# Altium schematic sheet BatteryBoxRight.SchDoc
size A1
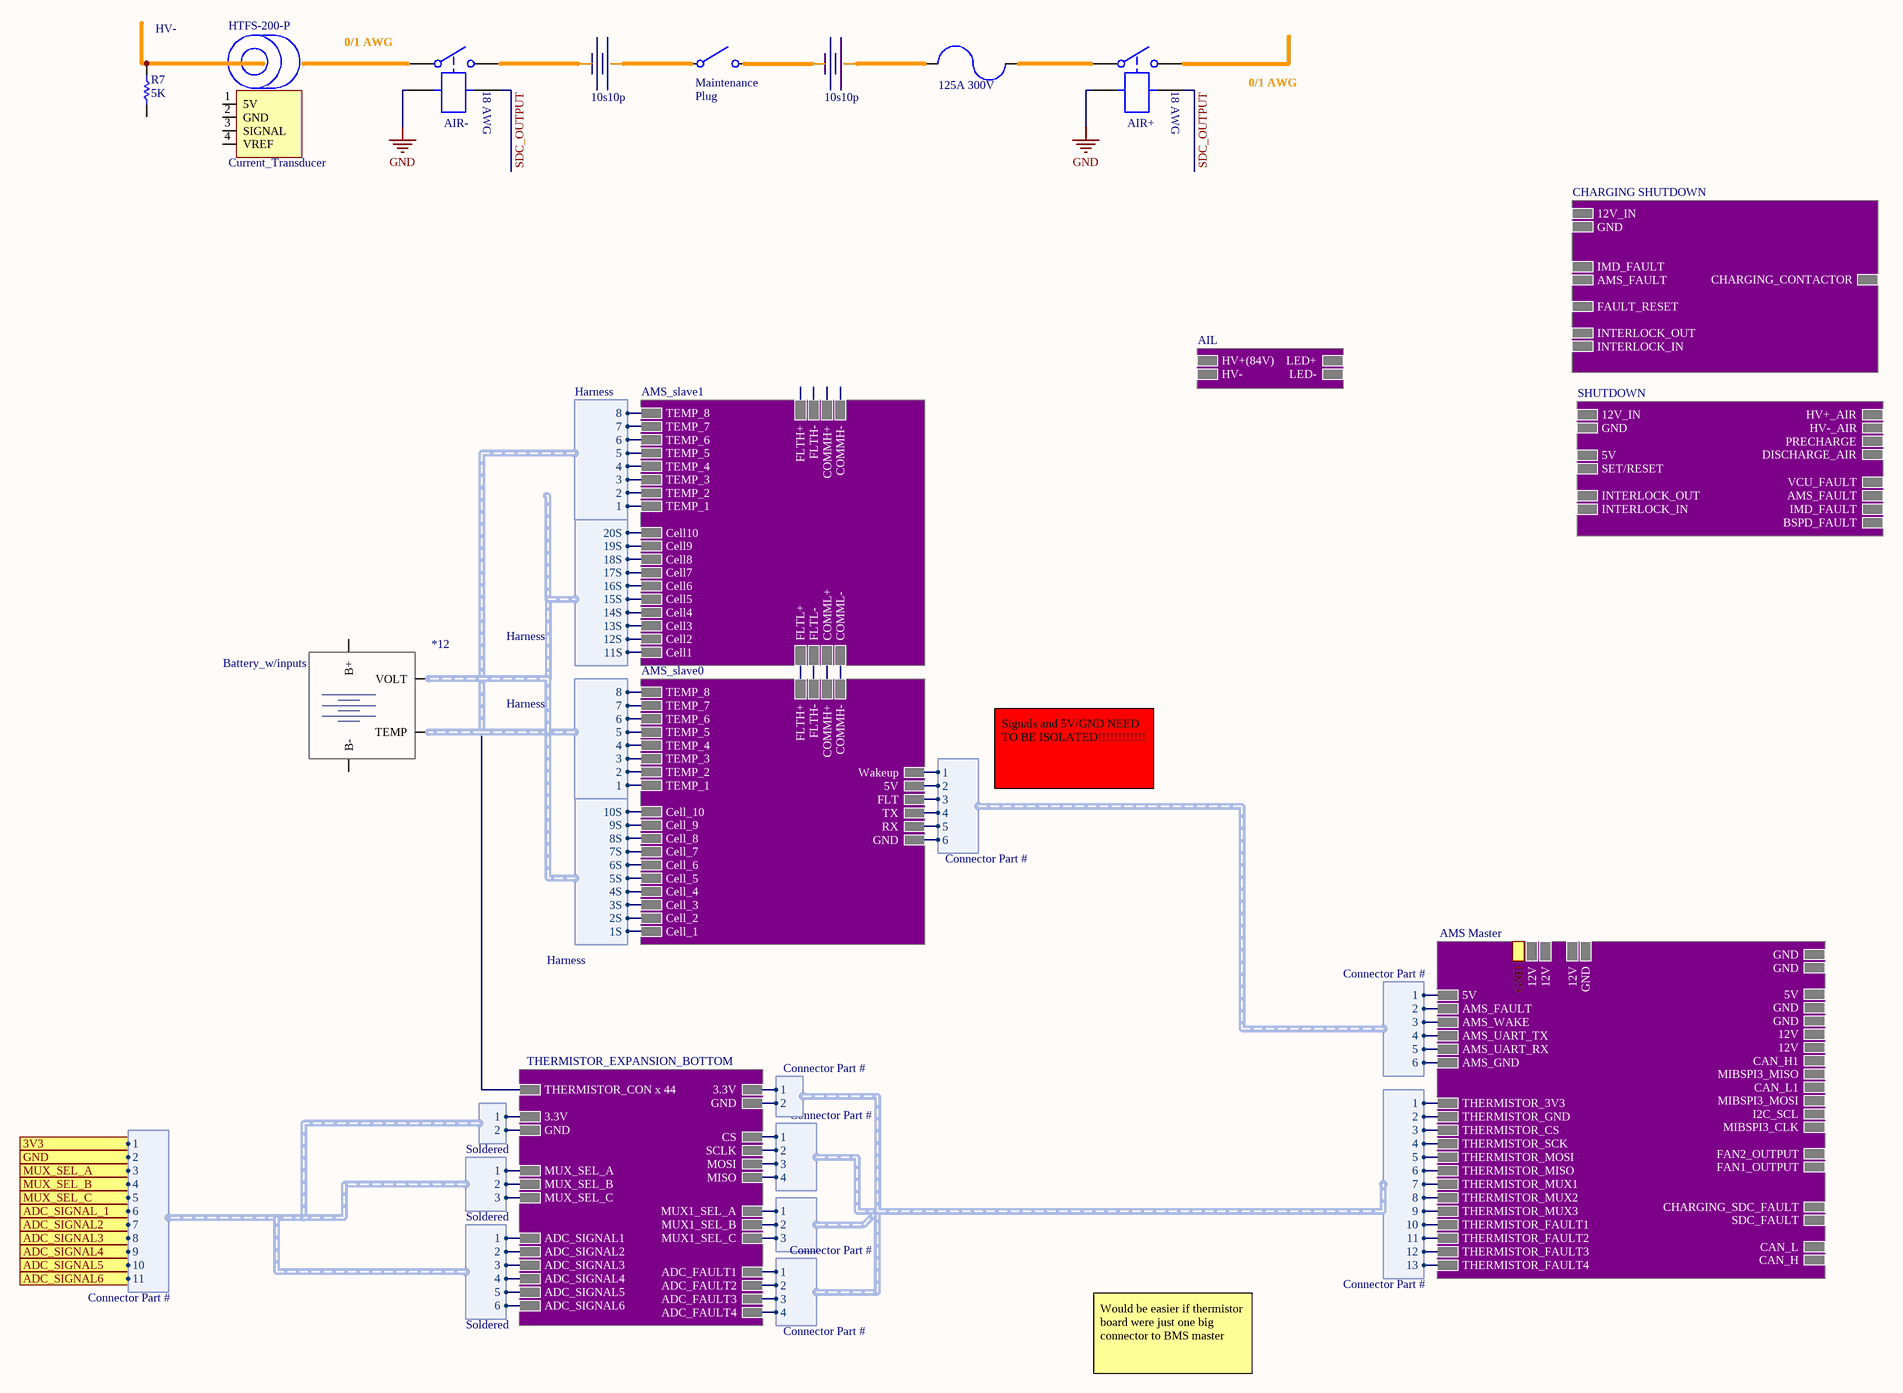
[diagram p0: BatteryBoxRight.SchDoc]

## Parts
10  AIR-
12  125A 300V
13  AIR+
*12  Battery_w/inputs
HTFS-200-P  Current_Transducer
N/A  10s10p
N/A1  10s10p
Plug4  Maintenance_Plug  (value not drawn)
R7  5K

## Sub-sheets
AIL = ?: HV+(84V), HV-, LED+, LED-
AMS Master = ?: 12V, 12V, GND, THERMISTOR_GND, THERMISTOR_3V3, THERMISTOR_FAULT4, THERMISTOR_FAULT3, THERMISTOR_FAULT2, THERMISTOR_FAULT1, THERMISTOR_MUX3, THERMISTOR_MUX2, THERMISTOR_MUX1, THERMISTOR_SCK, THERMISTOR_MISO, AMS_UART_TX, THERMISTOR_MOSI, AMS_UART_RX, THERMISTOR_CS, AMS_FAULT, AMS_WAKE, GND, GND, 5V, 5V, GND, GND, 12V, 12V, CAN_H1, MIBSPI3_MISO, CAN_L1, MIBSPI3_MOSI, I2C_SCL, MIBSPI3_CLK, FAN2_OUTPUT, FAN1_OUTPUT, CHARGING_SDC_FAULT, SDC_FAULT, CAN_L, CAN_H, 12V, GND, AMS_GND
AMS_slave0 = ?: Cell_10, Cell_9, Cell_8, Cell_7, Cell_6, Cell_5, Cell_4, Cell_3, Cell_2, Cell_1, FLTH+, FLTH-, COMMH+, COMMH-, FLT, RX, TX, GND, Wakeup, TEMP_1, TEMP_3, TEMP_4, TEMP_5, TEMP_6, TEMP_7, TEMP_8, TEMP_2, 5V
AMS_slave1 = ?: Cell10, Cell9, Cell8, Cell7, Cell6, Cell5, Cell4, Cell3, Cell2, Cell1, FLTH+, FLTH-, COMMH+, COMMH-, FLTL+, FLTL-, COMML+, COMML-, TEMP_1, TEMP_3, TEMP_4, TEMP_5, TEMP_6, TEMP_7, TEMP_8, TEMP_2
CHARGING SHUTDOWN = ?: 12V_IN, GND, IMD_FAULT, AMS_FAULT, FAULT_RESET, CHARGING_CONTACTOR, INTERLOCK_OUT, INTERLOCK_IN
SHUTDOWN = ?: 12V_IN, GND, DISCHARGE_AIR, PRECHARGE, IMD_FAULT, AMS_FAULT, BSPD_FAULT, SET/RESET, VCU_FAULT, HV+_AIR, HV-_AIR, INTERLOCK_OUT, INTERLOCK_IN, 5V
THERMISTOR_EXPANSION_BOTTOM = ?: CS, SCLK, MOSI, MISO, 3.3V, GND, MUX1_SEL_A, MUX1_SEL_B, MUX1_SEL_C, ADC_FAULT2, ADC_FAULT3, ADC_FAULT4, THERMISTOR_CON x 44, ADC_FAULT1, 3.3V, GND, MUX_SEL_A, MUX_SEL_B, ADC_SIGNAL6, ADC_SIGNAL5, ADC_SIGNAL4, ADC_SIGNAL3, ADC_SIGNAL2, ADC_SIGNAL1, MUX_SEL_C

## Ports
3V3 (harness Connector Part #), ADC_SIGNAL2 (harness Connector Part #), ADC_SIGNAL3 (harness Connector Part #), ADC_SIGNAL4 (harness Connector Part #), ADC_SIGNAL5 (harness Connector Part #), ADC_SIGNAL6 (harness Connector Part #), ADC_SIGNAL_1 (harness Connector Part #), GND (harness Connector Part #), MUX_SEL_A (harness Connector Part #), MUX_SEL_B (harness Connector Part #), MUX_SEL_C (harness Connector Part #)

## Harnesses
Harness: 20S, 19S, 18S, 17S, 16S, 15S, 14S, 13S, 12S, 11S
Harness: 10S, 9S, 8S, 7S, 6S, 5S, 4S, 3S, 2S, 1S
Harness: 1, 2, 3, 4, 5, 6, 7, 8
Connector Part #: 1, 2, 3, 4, 5, 6, 7, 8, 9, 10, 11, 12, 13
Connector Part #: 1, 2, 3, 4
Connector Part #: 1, 2
Connector Part #: 1, 2, 3
Connector Part #: 1, 2, 3, 4, 5, 6
Connector Part #: 6, 5, 4, 3, 2, 1
Soldered: 2, 1
Soldered: 3, 2, 1
Soldered: 6, 5, 4, 3, 2, 1
Connector Part #: 6, 7, 8, 9, 10, 11, 5, 4, 3, 2, 1

## Nets
GND: 10.4 13.4
SDC_OUTPUT: 10.4 13.4
Net10_4: 10.4 N/A1.2
Net12_1: 12.1 N/A.1
Net12_2: 12.2 13.4
Net*12_4: *12.4(TEMP) ; sheet THERMISTOR_EXPANSION_BOTTOM/THERMISTOR_CON x 44
NetN/A1_1: N/A1.1 Plug4.4
NetN/A_2: N/A.2 Plug4.4
(unnamed): sheet AMS_slave0/Cell_10, harness Harness.10S
(unnamed): sheet AMS_slave0/Cell_9, harness Harness.9S
(unnamed): sheet AMS_slave0/Cell_8, harness Harness.8S
(unnamed): sheet AMS_slave0/Cell_7, harness Harness.7S
(unnamed): sheet AMS_slave0/Cell_6, harness Harness.6S
(unnamed): sheet AMS_slave0/Cell_5, harness Harness.5S
(unnamed): sheet AMS_slave0/Cell_4, harness Harness.4S
(unnamed): sheet AMS_slave0/Cell_3, harness Harness.3S
(unnamed): sheet AMS_slave0/Cell_2, harness Harness.2S
(unnamed): sheet AMS_slave0/Cell_1, harness Harness.1S
(unnamed): sheet AMS_slave0/FLTH+, sheet AMS_slave1/FLTL+
(unnamed): sheet AMS_slave0/FLTH-, sheet AMS_slave1/FLTL-
(unnamed): sheet AMS_slave0/COMMH+, sheet AMS_slave1/COMML+
(unnamed): sheet AMS_slave0/COMMH-, sheet AMS_slave1/COMML-
(unnamed): sheet AMS_slave0/FLT, sheet AMS Master/AMS_WAKE, harness Connector Part #.3
(unnamed): sheet AMS_slave0/RX, sheet AMS Master/AMS_UART_RX, harness Connector Part #.5
(unnamed): sheet AMS_slave0/TX, sheet AMS Master/AMS_UART_TX, harness Connector Part #.4
(unnamed): sheet AMS_slave0/GND, sheet AMS Master/AMS_GND, harness Connector Part #.6
(unnamed): sheet AMS_slave0/Wakeup, sheet AMS Master/5V, harness Connector Part #.1
(unnamed): sheet AMS_slave0/TEMP_1, sheet AMS_slave1/TEMP_1, harness Harness.1
(unnamed): sheet AMS_slave0/TEMP_3, sheet AMS_slave1/TEMP_3, harness Harness.3
(unnamed): sheet AMS_slave0/TEMP_4, sheet AMS_slave1/TEMP_4, harness Harness.4
(unnamed): sheet AMS_slave0/TEMP_5, sheet AMS_slave1/TEMP_5, harness Harness.5
(unnamed): sheet AMS_slave0/TEMP_6, sheet AMS_slave1/TEMP_6, harness Harness.6
(unnamed): sheet AMS_slave0/TEMP_7, sheet AMS_slave1/TEMP_7, harness Harness.7
(unnamed): sheet AMS_slave0/TEMP_8, sheet AMS_slave1/TEMP_8, harness Harness.8
(unnamed): sheet AMS_slave0/TEMP_2, sheet AMS_slave1/TEMP_2, harness Harness.2
(unnamed): sheet AMS_slave0/5V, sheet AMS Master/AMS_FAULT, harness Connector Part #.2
(unnamed): sheet AMS_slave1/Cell10, harness Harness.20S
(unnamed): sheet AMS_slave1/Cell9, harness Harness.19S
(unnamed): sheet AMS_slave1/Cell8, harness Harness.18S
(unnamed): sheet AMS_slave1/Cell7, harness Harness.17S
(unnamed): sheet AMS_slave1/Cell6, harness Harness.16S
(unnamed): sheet AMS_slave1/Cell5, harness Harness.15S
(unnamed): sheet AMS_slave1/Cell4, harness Harness.14S
(unnamed): sheet AMS_slave1/Cell3, harness Harness.13S
(unnamed): sheet AMS_slave1/Cell2, harness Harness.12S
(unnamed): sheet AMS_slave1/Cell1, harness Harness.11S
(unnamed): sheet THERMISTOR_EXPANSION_BOTTOM/CS, sheet THERMISTOR_EXPANSION_BOTTOM/3.3V, sheet THERMISTOR_EXPANSION_BOTTOM/MUX1_SEL_A, sheet THERMISTOR_EXPANSION_BOTTOM/ADC_FAULT1, sheet AMS Master/THERMISTOR_3V3, harness Connector Part #.1
(unnamed): sheet THERMISTOR_EXPANSION_BOTTOM/SCLK, sheet THERMISTOR_EXPANSION_BOTTOM/GND, sheet THERMISTOR_EXPANSION_BOTTOM/MUX1_SEL_B, sheet THERMISTOR_EXPANSION_BOTTOM/ADC_FAULT2, sheet AMS Master/THERMISTOR_GND, harness Connector Part #.2
(unnamed): sheet THERMISTOR_EXPANSION_BOTTOM/MOSI, sheet THERMISTOR_EXPANSION_BOTTOM/MUX1_SEL_C, sheet THERMISTOR_EXPANSION_BOTTOM/ADC_FAULT3, sheet AMS Master/THERMISTOR_CS, harness Connector Part #.3
(unnamed): sheet THERMISTOR_EXPANSION_BOTTOM/MISO, sheet THERMISTOR_EXPANSION_BOTTOM/ADC_FAULT4, sheet AMS Master/THERMISTOR_SCK, harness Connector Part #.4
(unnamed): sheet THERMISTOR_EXPANSION_BOTTOM/3.3V, sheet THERMISTOR_EXPANSION_BOTTOM/MUX_SEL_A, sheet THERMISTOR_EXPANSION_BOTTOM/ADC_SIGNAL1, harness Soldered.1, harness Connector Part #.1
(unnamed): sheet THERMISTOR_EXPANSION_BOTTOM/GND, sheet THERMISTOR_EXPANSION_BOTTOM/MUX_SEL_B, sheet THERMISTOR_EXPANSION_BOTTOM/ADC_SIGNAL2, harness Soldered.2, harness Connector Part #.2
(unnamed): sheet THERMISTOR_EXPANSION_BOTTOM/ADC_SIGNAL6, harness Soldered.6, harness Connector Part #.6
(unnamed): sheet THERMISTOR_EXPANSION_BOTTOM/ADC_SIGNAL5, harness Soldered.5, harness Connector Part #.5
(unnamed): sheet THERMISTOR_EXPANSION_BOTTOM/ADC_SIGNAL4, harness Soldered.4, harness Connector Part #.4
(unnamed): sheet THERMISTOR_EXPANSION_BOTTOM/ADC_SIGNAL3, sheet THERMISTOR_EXPANSION_BOTTOM/MUX_SEL_C, harness Soldered.3, harness Connector Part #.3
(unnamed): sheet AMS Master/THERMISTOR_FAULT4, harness Connector Part #.13
(unnamed): sheet AMS Master/THERMISTOR_FAULT3, harness Connector Part #.12
(unnamed): sheet AMS Master/THERMISTOR_FAULT2, harness Connector Part #.11
(unnamed): sheet AMS Master/THERMISTOR_FAULT1, harness Connector Part #.10
(unnamed): sheet AMS Master/THERMISTOR_MUX3, harness Connector Part #.9
(unnamed): sheet AMS Master/THERMISTOR_MUX2, harness Connector Part #.8
(unnamed): sheet AMS Master/THERMISTOR_MUX1, harness Connector Part #.7
(unnamed): sheet AMS Master/THERMISTOR_MISO, harness Connector Part #.6
(unnamed): sheet AMS Master/THERMISTOR_MOSI, harness Connector Part #.5

Not connected (* = marked no-connect by the designer): *12 1(B+) 2(B-) 3(VOLT); HTFS-200-P 1(5V) 2(GND) 3(SIGNAL) 4(VREF); R7 1 2

## Notes on the sheet
- (near R7) HV-
- (near 10) 0/1 AWG
- (near 10) 18 AWG
- (near Plug4) Maintenance
- (near Plug4) Plug
- (near 13) 18 AWG
- 0/1 AWG
- Signals and 5V/GND NEED TO BE ISOLATED!!!!!!!!!!!!
- Would be easier if thermistor board were just one big connector to BMS master

## Library data of the parts
10 13 = AIR_Detailed
12 = FUSE
N/A N/A1 = Battery_Half
R7 = RES